# EasyEDA schematic schematic.easyeda.json
TITLE: Smart PWM Fan Controller; REV: 1.0; Date: 2025-04-26; Sheet: 1/1; Drawn By: Joshua M. Boniface
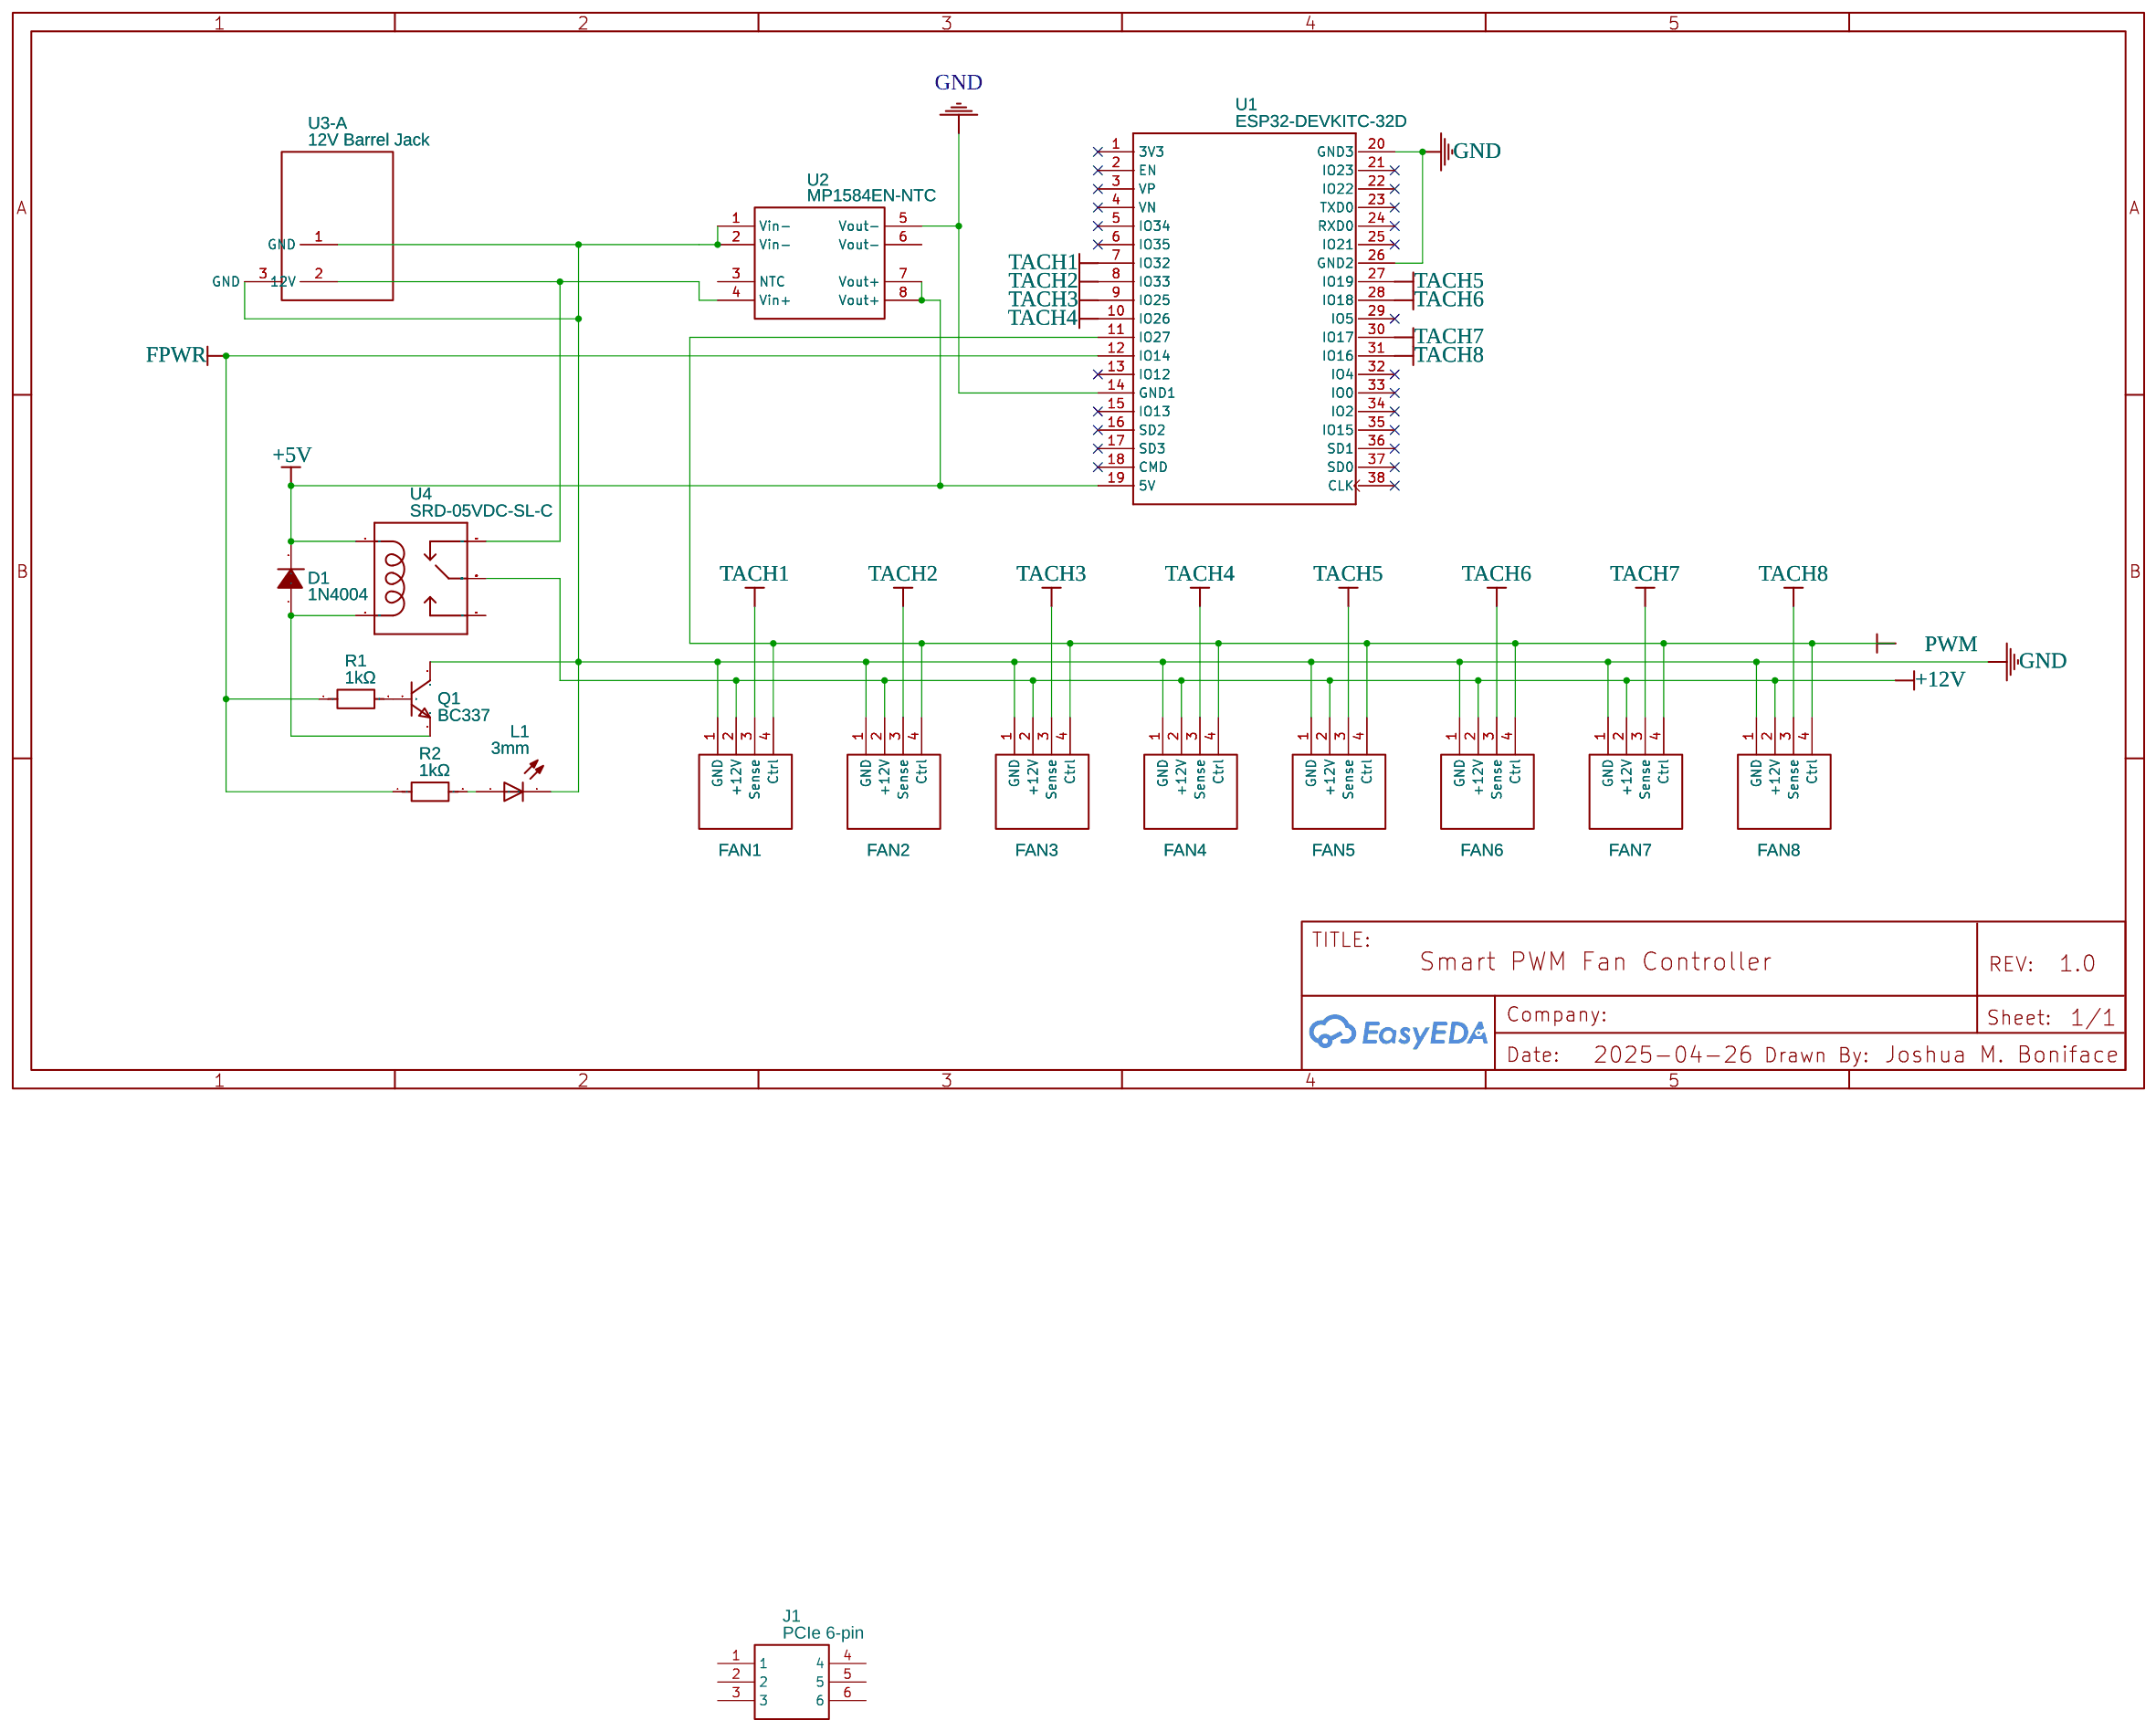
[diagram p0: schematic sheet]

## Parts
D1  1N4004  [DIODE_1N4007]
FAN1  4 Pin PWM Fan Header  [4 PIN PWM FAN HEADER]
FAN2  4 Pin PWM Fan Header  [4 PIN PWM FAN HEADER]
FAN3  4 Pin PWM Fan Header  [4 PIN PWM FAN HEADER]
FAN4  4 Pin PWM Fan Header  [4 PIN PWM FAN HEADER]
FAN5  4 Pin PWM Fan Header  [4 PIN PWM FAN HEADER]
FAN6  4 Pin PWM Fan Header  [4 PIN PWM FAN HEADER]
FAN7  4 Pin PWM Fan Header  [4 PIN PWM FAN HEADER]
FAN8  4 Pin PWM Fan Header  [4 PIN PWM FAN HEADER]
J1  PCIe 6-pin  [MOLEX_MINIFIT-JR-5569-06A2_2X03X4.20MM_ANGLED]
L1  3mm  [LED_LED3MM]
Q1  BC337  [TO-92-3_L4.9-W3.7-P1.27-L]
R1  1kΩ  [1/4W-RESISTOR-VERTICAL]
R2  1kΩ  [1/4W-RESISTOR-VERTICAL]
U1  ESP32-DEVKITC-32D  [ESP32-DEVKITC_NARROW_JB]
U2  MP1584EN-NTC  [MP1584EN]
U3-A  12V Barrel Jack  [PJ-002A]
U4  SRD-05VDC-SL-C  [SRD-05VDC-SL-C]

## Library data of the parts
D1 = 1N4007: Manufacturer: ST(先科); Supplier Part: C106903; JLCPCB Part Class: Extended Part; Contributor: Darvin995
FAN1-FAN8 = 4 Pin PWM Fan Header: Contributor: reakevin.05
J1 = PCIe 6-pin: Contributor: avorozcovs; sourceId: HEyQK2kew
L1 = LED 3MM: Contributor: Debik
Q1 = 2N2222: Contributor: LCSC; Supplier: LCSC; Manufacturer: ST(先科); Manufacturer Part: 2N2222A; Supplier Part: C118536; JLCPCB Part Class: Extended Part
R1 R2 = 1/4 W Resistor Vertical: Contributor: rogerbrot
U1 = ESP32-DEVKITC-32D HAT TEMPLATE: Contributor: sebyldino; Package Display: No
U2 = MP1584EN-NTC COPY: Contributor: mchahn
U3-A = 12V Barrel Jack: Contributor: a_caldwell27
U4 = 12V RELAY: SPDT relay (COM-00101)

## Nets
+5V: D1.2(K) U1.19(5V) U2.7(Vout+) U2.8(Vout+) U4.COIL1
+12V: FAN1.2(+12V) FAN2.2(+12V) FAN3.2(+12V) FAN4.2(+12V) FAN5.2(+12V) FAN6.2(+12V) FAN7.2(+12V) FAN8.2(+12V) U4.SWCOMMON
GND: FAN1.1(GND) FAN2.1(GND) FAN3.1(GND) FAN4.1(GND) FAN5.1(GND) FAN6.1(GND) FAN7.1(GND) FAN8.1(GND) L1.K(2) Q1.3(C) U1.14(GND1) U1.20(GND3) U1.26(GND2) U2.1(Vin-) U2.2(Vin-) U2.5(Vout-) U3-A.1(GND)
FPWR: R1.1 R2.1 U1.12(IO14)
PWM: FAN1.4(Ctrl) FAN2.4(Ctrl) FAN3.4(Ctrl) FAN4.4(Ctrl) FAN5.4(Ctrl) FAN6.4(Ctrl) FAN7.4(Ctrl) FAN8.4(Ctrl) U1.11(IO27)
TACH1: FAN1.3(Sense) U1.7(IO32)
TACH2: FAN2.3(Sense) U1.8(IO33)
TACH3: FAN3.3(Sense) U1.9(IO25)
TACH4: FAN4.3(Sense) U1.10(IO26)
TACH5: FAN5.3(Sense) U1.27(IO19)
TACH6: FAN6.3(Sense) U1.28(IO18)
TACH7: FAN7.3(Sense) U1.30(IO17)
TACH8: FAN8.3(Sense) U1.31(IO16)
Net-(D1-1): D1.1(A) Q1.1(E) U4.COIL0
Net-(L1-A): L1.A(1) R2.2
Net-(Q1-2): Q1.2(B) R1.2
Net-(U2-4): U2.4(Vin+) U3-A.2(12V) U4.SWCLOSED(SWCLOSE)

Not connected (* = marked no-connect by the designer): J1 1 2 3 4 5 6; U1 1(3V3)* 2(EN)* 3(VP)* 4(VN)* 5(IO34)* 6(IO35)* 13(IO12)* 15(IO13)* 16(SD2)* 17(SD3)* 18(CMD)* 21(IO23)* 22(IO22)* 23(TXD0)* 24(RXD0)* 25(IO21)* 29(IO5)* 32(IO4)* 33(IO0)* 34(IO2)* 35(IO15)* 36(SD1)* 37(SD0)* 38(CLK)*; U2 3(NTC) 6(Vout-); U3-A 3(GND); U4 SWOPEN
